# EAGLE design RTC (EAGLE 7.1.0)
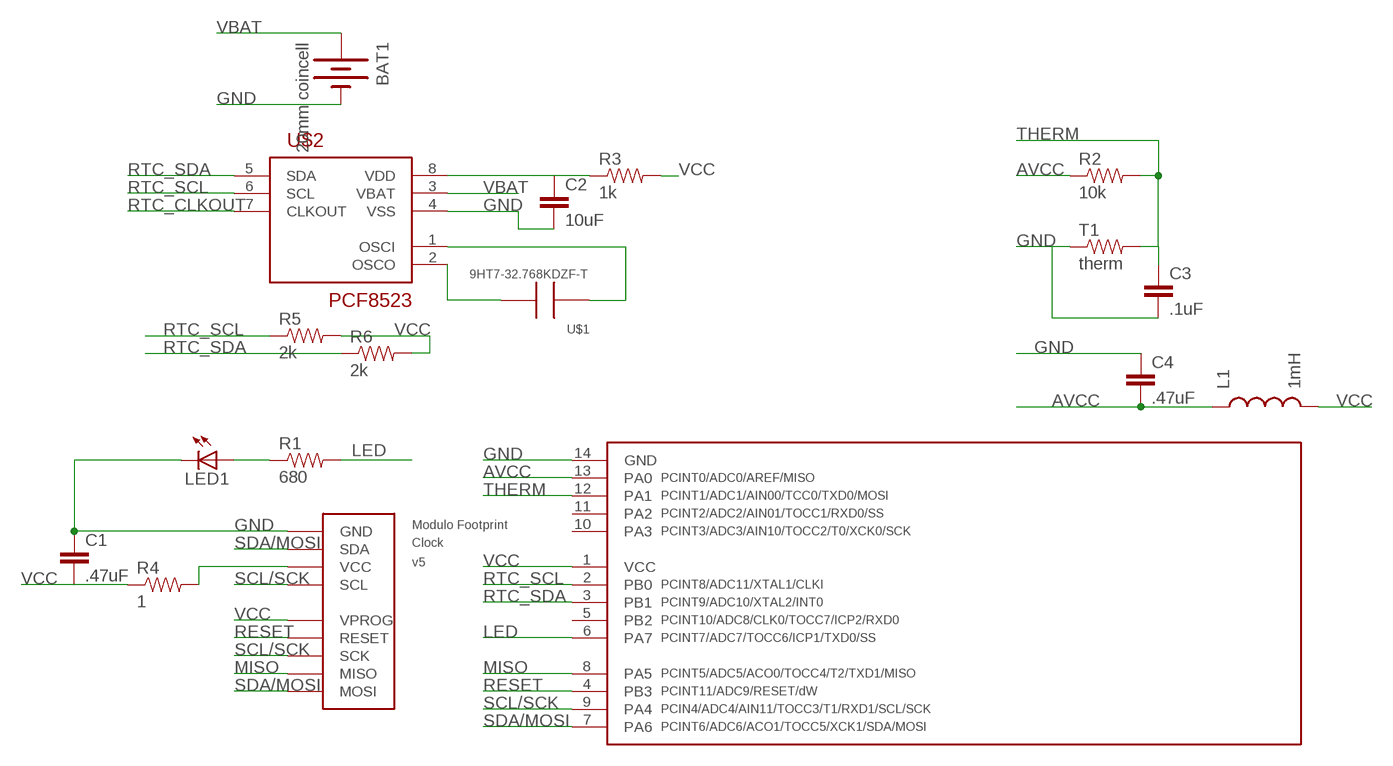
[diagram p0: schematic, sheet 1]

## Parts
BAT1  20mm coincell  BATTERY20MM_4LEGS  [BATTCON_20MM_4LEGS]
C1  .47uF  CAP0805  [0805]
C2  10uF  CAP0805  [0805]
C3  .1uF  CAP0805  [0805]
C4  .47uF  CAP0805  [0805]
L1  1mH  INDUCTOR1007  [1007]
LED1  LEDCHIP-LED0805  [CHIP-LED0805]
R1  680  RESISTOR0805-RES  [0805]
R2  10k  RESISTOR0805-RES  [0805]
R3  1k  RESISTOR0805-RES  [0805]
R4  1  RESISTOR0805-RES  [0805]
R5  2k  RESISTOR0805-RES  [0805]
R6  2k  RESISTOR0805-RES  [0805]
T1  therm  RESISTOR0805-RES  [0805]
U$1  9HT7-32.768KDZF-T  CRYSTALABS25  [CRYSTAL-ABS25]
U$2  PCF8523  [SOIC-8]
U$3  TINY841  [SOIC14]
U$4  FOOTPRINTFOOTPRINT-2  [FOOTPRINT2]

## Nets
AVCC: C4.2 L1.1 R2.1 U$3.13(PA0)
GND: BAT1.2(-) C1.1 C2.2 C3.2 C4.1 LED1.C T1.1 U$2.4(VSS) U$3.14(GND) U$4.BUS0(GND)
LED: R1.2 U$3.6(PA7)
MISO: U$3.8(PA5) U$4.PROG3(MISO)
N$2: R4.2 U$4.BUS2(VCC)
N$3: C2.1 R3.1 U$2.8(VDD)
N$4: U$1.P$1 U$2.1(OSCI)
N$5: LED1.A R1.1
N$6: U$1.P$4 U$2.2(OSCO)
RESET: U$3.4(PB3) U$4.PROG1(RESET)
RTC_CLKOUT: U$2.7(CLKOUT)
RTC_SCL: R5.1 U$2.6(SCL) U$3.2(PB0)
RTC_SDA: R6.1 U$2.5(SDA) U$3.3(PB1)
SCL/SCK: U$3.9(PA4) U$4.BUS3(SCL) U$4.PROG2(SCK)
SDA/MOSI: U$3.7(PA6) U$4.BUS1(SDA) U$4.PROG4(MOSI)
THERM: C3.1 R2.2 T1.2 U$3.12(PA1)
VBAT: BAT1.1(+) U$2.3(VBAT)
VCC: C1.2 L1.2 R3.2 R4.1 R5.2 R6.2 U$3.1(VCC) U$4.PROG0(VPROG)
Unconnected: U$3.5(PB2) U$3.10(PA3) U$3.11(PA2)

## Library data of the parts
BAT1 = SparkFun-Electromechanical:BATTERY: Battery Holders Various common sizes : AA, AAA, 20mm coin cell and 12mm coin cell. 20MM_4LEGS, BATT-10373; PROD_ID: BATT-10373
C1 C3 C4 = SparkFun-Capacitors:CAP: Capacitor Standard 0603 ceramic capacitor, and 0.1" leaded capacitor.
C2 = SparkFun-Passives:CAP: Capacitor Standard 0603 ceramic capacitor, and 0.1" leaded capacitor.
L1 = SparkFun-Passives:INDUCTOR: Inductors Basic Inductor/Choke - 0603 and 1206. Footprints are not proven and vary greatly between part numbers. SRN6045- 33uH, 20% 1.4A SDR0403-560KL - 56uH, 10%, 500mA RMS/740mA peak
LED1 = adafruit:LED: LED OSRAM: - CHIPLED LG R971, LG N971, LY N971, LG Q971, LY Q971, LO R971, LY R971 LH N974, LH R974 LS Q976, LO Q976, LY Q976 LO Q996 - Hyper CHIPLED LW Q18S LB Q993, LB Q99A, LB R99A - SideLED LS A670, LO A670, LY A670, LG A670, LP A670 LB A673, LV A673, LT A673, LW A673 LH A674 LY A675 LS A676, LA A676, LO A676, LY A676, LW A676 LS A679, LY A679, LG A679 - Hyper Micro SIDELED® LS Y876, LA Y876, LO Y876, LY Y876 LT Y87S - SmartLED LW L88C, LW L88S LB L89C, LB L89S, LG L890 LS L89K, LO L89K, LY L89K LS L896, LA L896, LO L896, LY L896 - TOPLED LS T670, LO T670, LY T670, LG T670, LP T670 LSG T670, LSP T670, LSY T670, LOP T670, LYG T670 LG T671, LOG T671, LSG T671 LB T673, LV T673, LT T673, LW T673 LH T674 LS T676, LA T676, LO T676, LY T676, LB T676, LH T676, LSB T676, LW T676 LB T67C, LV T67C, LT T67C, LS T67K, LO T67K, LY T67K, LW E67C LS E67B, LA E67B, LO E67B, LY E67B, LB E67C, LV E67C, LT E67C LW T67C LS T679, LY T679, LG T679 LS T770, LO T770, LY T770, LG T770, LP T770 LB T773, LV T773, LT T773, LW T773 LH T774 LS E675, LA E675, LY E675, LS T675 LS T776, LA T776, LO T776, LY T776, LB T776 LHGB T686 LT T68C, LB T68C - Hyper Mini TOPLED® LB M676 - Mini TOPLED Santana® LG M470 LS M47K, LO M47K, LY M47K Source: http://www.osram.convergy.de/
R1-R3 T1 = SparkFun-Passives:RESISTOR: Resistor Basic schematic elements and footprints for 0603, 1206, and PTH resistors.
R4-R6 = SparkFun-Resistors:RESISTOR: Resistor Basic schematic elements and footprints for 0603, 1206, and PTH resistors.
U$1 = IntegerLabs:CRYSTAL
U$2 = IntegerLabs:PCF8523
U$3 = IntegerLabs:TINY841
U$4 = IntegerLabs:FOOTPRINT: Modulo Footprint; BOARD: Clock; VERSION: v5

## Board
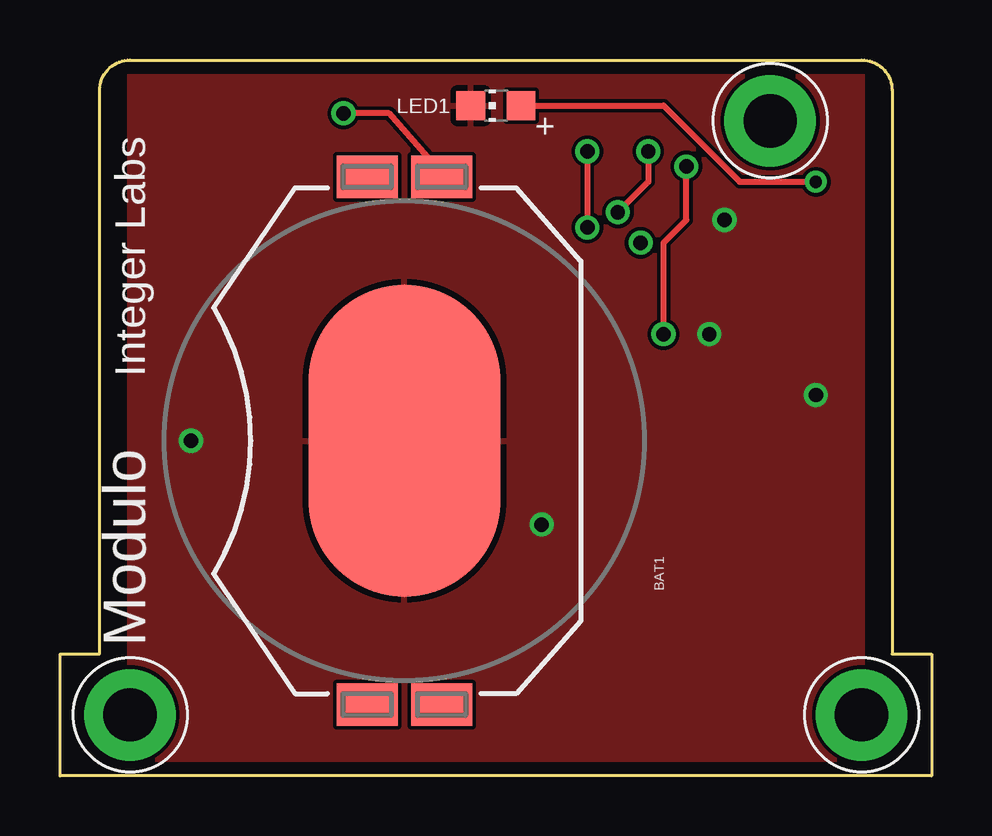
[diagram p1: board, top side]
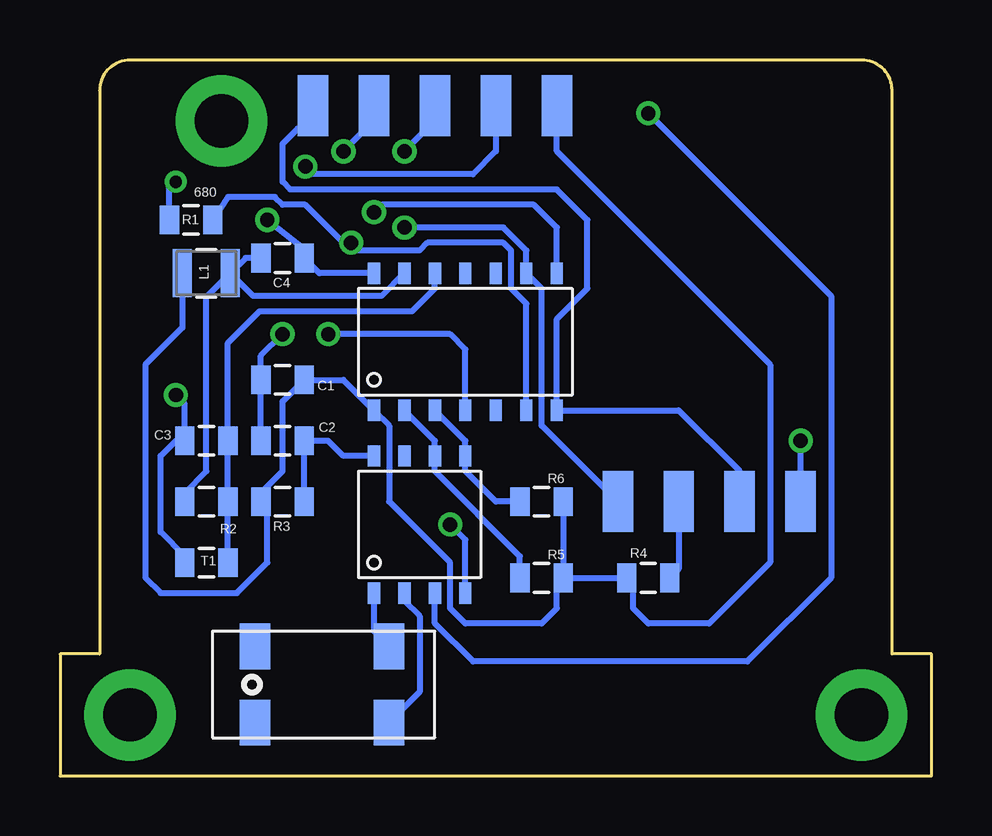
[diagram p2: board, bottom side, seen from below]

Size 36.32 x 29.84 mm. Coordinates in mm from the lower left corner, seen from the top.
Copper layers (1*16): Top 0.0178mm / dielectric 59mil / Bottom 0.0178mm
Design rules "SSC-EAGLE-2Lyr_v1.0.0.3": minimum track width 6mil, minimum drill 14mil, track to track 6mil, track to pad 6mil, pad to pad 6mil, via to via 6mil, smd to smd 6mil, copper to edge 20mil, drill to drill 16mil, minimum pad ring 8mil, minimum via ring 8mil, stop-mask expansion 3mil, vias tented up to drill 0mil, thermal gap 10mil

### Footprints (pad centres in the part's own frame; a part is rotated, then mirrored left to right if it is on the bottom)
BATTCON_20MM_4LEGS = smd 1.778 x 2.54: 1 -11,1.55; 3 11,1.55; P$1 -11,-1.55; P$2 11,-1.55 | smd 13 x 8: 2 0,0
0805 = smd 0.8 x 1.2: 1 -0.9,0; 2 0.9,0
1007 = smd 2 x 0.8: 1 0,1; 2 0,-1
CHIP-LED0805 = smd 1.2 x 1.2: A 0,-1.05; C 0,1.05
CRYSTAL-ABS25 = smd 1.27 x 1.905: P$1 0,0; P$2 5.588,0; P$3 5.588,3.175; P$4 0,3.175
SOIC-8 = smd 0.508 x 0.889: 1 -1.27,-3.175; 2 0,-3.175; 3 1.27,-3.175; 4 2.54,-3.175; 5 2.54,2.54; 6 1.27,2.54; 7 0,2.54; 8 -1.27,2.54
SOIC14 = smd 0.508 x 0.889: 1 0,-3.175; 2 1.27,-3.175; 3 2.54,-3.175; 4 3.81,-3.175; 5 5.08,-3.175; 6 6.35,-3.175; 7 7.62,-3.175; 8 7.62,2.54; 9 6.35,2.54; 10 5.08,2.54; 11 3.81,2.54; 12 2.54,2.54; 13 1.27,2.54; 14 0,2.54
FOOTPRINT2 = smd 1.27 x 2.54 bottom: BUS0 5.08,11.43; BUS1 7.62,11.43; BUS2 10.16,11.43; BUS3 12.7,11.43; PROG0 15.24,27.94; PROG1 17.78,27.94; PROG2 20.32,27.94; PROG3 22.86,27.94; PROG4 25.4,27.94 | drill 2.223 pad 3.81: P$1 2.54,2.54; P$2 33.02,2.54; P$3 29.21,27.305

### Placement (x,y rotation side)
BAT1  14.35,13.97 270 top
C1  27.05,16.51 0 bottom
C2  27.05,13.97 180 bottom
C3  30.23,13.97 180 bottom
C4  27.05,21.59 180 bottom
L1  30.23,20.95 270 bottom
LED1  18.16,27.94 90 top
R1  30.86,23.18 0 bottom
R2  30.23,11.43 0 bottom
R3  27.05,11.43 180 bottom
R4  11.81,8.26 0 bottom
R5  16.26,8.26 0 bottom
R6  16.26,11.43 0 bottom
T1  30.23,8.89 0 bottom
U$1  22.61,5.4 180 bottom
U$2  21.97,10.79 0 bottom
U$3  23.24,18.41 0 bottom
U$4  0.38,0 0 top

### Tracks (layer width: path | path; a pad name or v marks a point on that pad's centre or on a via)
AVCC
  Bottom 0.254: R2.1 31.13,11.8 30.23,12.7 30.23,19.95 L1.1 | U$3.13 22.92,20 28.27,20 L1.1 | C4.2 28.59,21.59 L1.1
GND  (via drill 0.6)
  Top 0.254: BAT1.2 10.54,13.97
  Bottom 0.254: T1.1 31.13,9.15 32.13,10.16 32.13,13.34 31.5,13.97 C3.2 31.13,15.51 v31.5,15.88 | C2.2 C1.1 27.95,17.52 v27.05,18.41 | U$2.4 19.43,9.84 v20.07,10.48 | U$4.BUS0 v5.46,13.97 | v27.69,23.18 26.15,21.96 C4.1 25.52,20.95 U$3.14
  pour Top: 2.92,30.48 33.4,30.48 33.4,0 2.92,0
LED  (via drill 0.6)
  Bottom 0.254: U$3.6 16.89,19.68 17.53,20.32 17.53,21.91 17.84,22.23 21.02,22.23 21.34,21.91 23.88,21.91 v24.19,22.23 24.51,22.23 26.1,23.81 27.05,23.81 27.37,24.13 29.33,24.13 R1.2
MISO  (via drill 0.6)
  Top 0.254: v24.51,26.04 24.51,24.77 v23.24,23.5
  Bottom 0.254: U$3.8 15.62,22.86 16.57,23.81 22.92,23.81 v23.24,23.5 | U$4.PROG3 23.24,27.3 v24.51,26.04
N$2
  Bottom 0.254: U$4.BUS2 10.54,8.62 R4.2
N$3
  Bottom 0.254: R3.1 C2.1 25.15,13.97 24.51,13.34 U$2.8
N$4
  Bottom 0.254: U$2.1 23.24,6.03 U$1.P$1
N$5  (via drill 0.51)
  Top 0.254: LED1.A 25.15,27.94 28.32,24.77 v31.5,24.77
  Bottom 0.254: R1.1 31.76,24.71 v31.5,24.77
N$6
  Bottom 0.254: U$2.2 21.97,7.3 21.34,6.67 21.34,3.49 U$1.P$4
RESET  (via drill 0.6)
  Top 0.254: v25.15,18.41 25.15,22.23 26.1,23.18 v26.1,25.4
  Bottom 0.254: U$3.4 19.43,17.78 20.07,18.41 v25.15,18.41 | U$4.PROG1 18.16,26.04 19.11,25.08 26.1,25.08 v26.1,25.4
RTC_SCL
  Bottom 0.254: U$3.2 20.7,13.97 U$2.6 20.7,12.7 17.16,9.15 R5.1
RTC_SDA
  Bottom 0.254: R6.1 18.16,11.43 19.43,12.7 U$2.5 19.43,13.97 U$3.3
SCL/SCK  (via drill 0.6)
  Top 0.254: v21.97,26.04 v21.97,22.86
  Bottom 0.254: U$4.BUS3 16.26,14.61 16.26,20.32 U$3.9 16.89,21.91 17.84,22.86 v21.97,22.86 | U$4.PROG2 20.7,27.3 v21.97,26.04
SDA/MOSI
  Bottom 0.254: U$4.BUS1 8,12.7 10.54,15.24 U$3.7 15.62,19.05 14.35,20.32 14.35,23.18 15.62,24.45 26.73,24.45 27.05,24.77 27.05,26.35 26.42,26.99 26.1,26.99 25.78,27.3 U$4.PROG4
THERM
  Bottom 0.254: T1.2 R2.2 C3.1 29.33,18.05 28,19.37 21.65,19.37 20.7,20.32 U$3.12
VBAT  (via drill 0.6)
  Top 0.254: BAT1.1 15.9,25.12 13.72,27.62 v11.81,27.62
  Bottom 0.254: v11.81,27.62 4.19,20 4.19,8.26 7.68,4.76 19.11,4.76 20.7,6.35 U$2.3
VCC
  Bottom 0.254: R6.2 R5.2 | R5.2 R4.1 12.45,7.99 12.45,6.99 11.81,6.35 9.27,6.35 6.73,8.89 6.73,17.14 15.62,26.04 U$4.PROG0 | R5.2 15.62,7.99 15.62,6.99 16.26,6.35 19.43,6.35 20.07,6.99 20.07,8.89 22.61,11.43 22.61,14.61 U$3.1 24.51,16.51 C1.2 27.05,15.61 27.05,12.7 27.95,11.8 R3.2 27.69,11.16 27.69,8.89 28.96,7.62 32.13,7.62 32.77,8.26 32.77,17.14 31.23,18.68 L1.2